# Altium schematic sheet FoxSense_Microcontroller.SchDoc
size A4; SheetNumber: 3; SheetTotal: 3
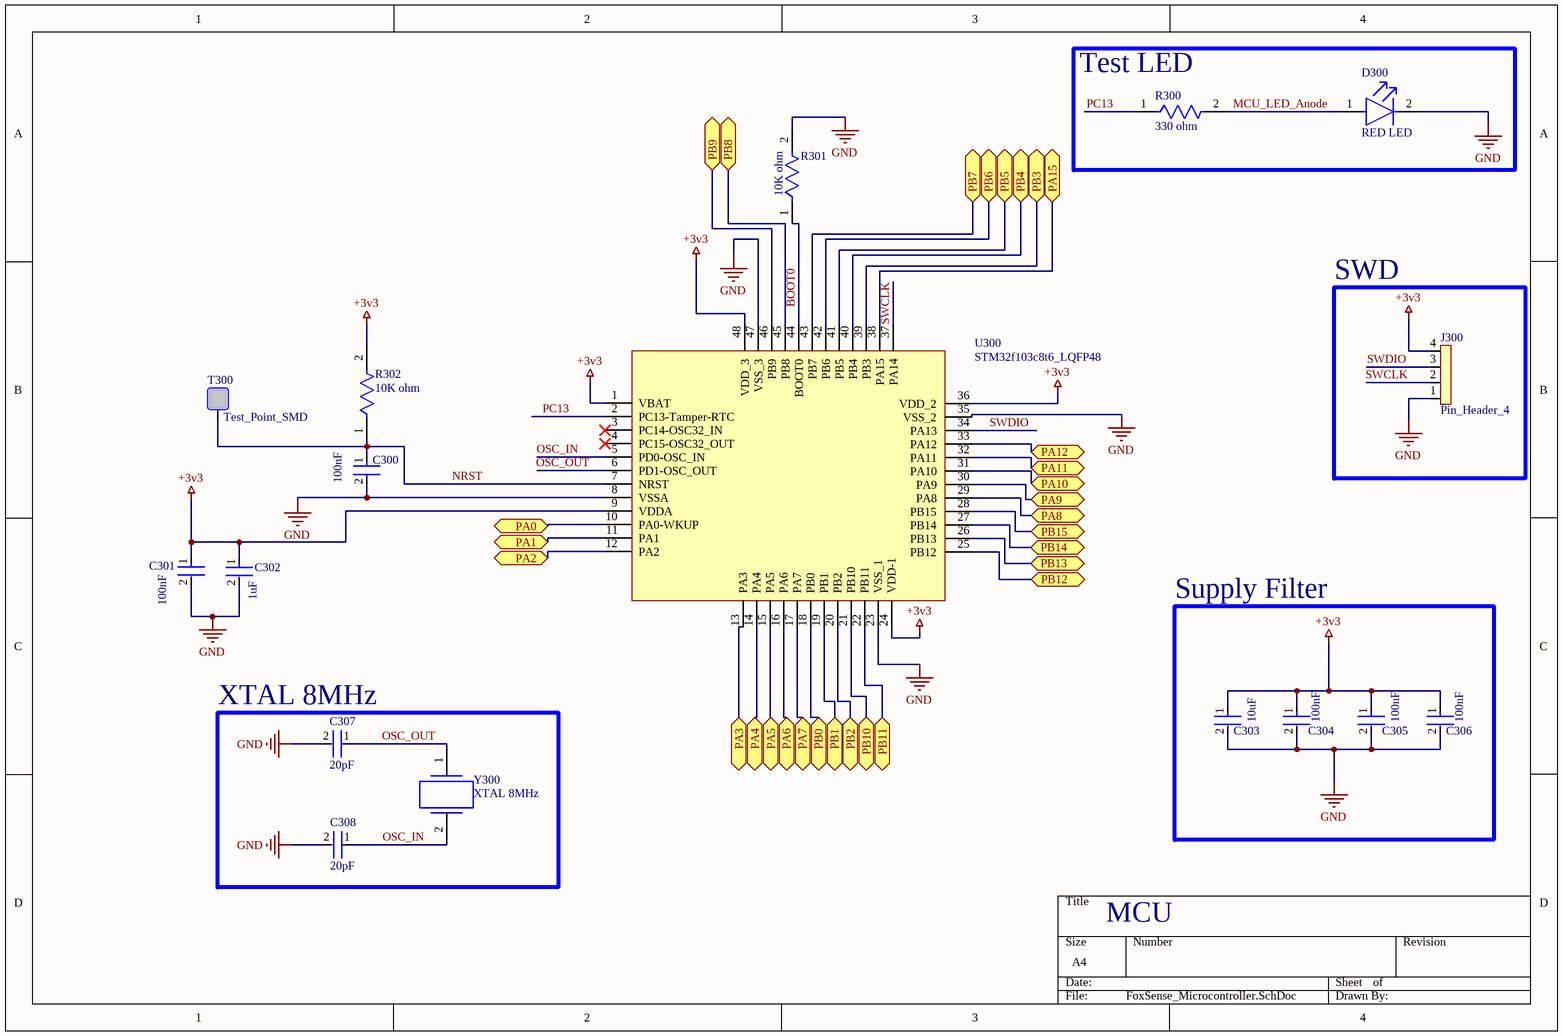
[diagram p0: FoxSense_Microcontroller.SchDoc]

## Parts
C300  100nF  [Capacitor_SMD_0805]
C301  100nF  [Capacitor_SMD_0805]
C302  1uF  [Capacitor_SMD_0805]
C303  10uF  [Capacitor_SMD_0805]
C304  100nF  [Capacitor_SMD_0805]
C305  100nF  [Capacitor_SMD_0805]
C306  100nF  [Capacitor_SMD_0805]
C307  20pF  [Capacitor_SMD_0805]
C308  20pF  [Capacitor_SMD_0805]
D300  RED LED  [LED_SMD_0805]
J300  Pin_Header_4  [Header4]
R300  330 ohm  [Resistor_SMD_0805]
R301  10K ohm  [Resistor_SMD_0805]
R302  10K ohm  [Resistor_SMD_0805]
T300  Test_Point_SMD  [TEST_Point_SMD]
U300  STM32f103c8t6_LQFP48  [STM32f103c8t6_LQFP48]
Y300  XTAL 8MHz  [Crystal_Resonator_SMD_XTAL]

## Blocks framed on the sheet
Test LED: D300 R300
SWD: J300
Supply Filter: C303-C306
XTAL 8MHz: C307 C308 Y300

## Ports
PA0 (bidir, see FoxSense_Schematic[2A]), PA1 (bidir, see FoxSense_Schematic[2B]), PA2 (bidir, see FoxSense_Schematic[2B]), PA3 (bidir, see FoxSense_Schematic[2B]), PA4 (bidir, see FoxSense_Schematic[2B]), PA5 (bidir, see FoxSense_Schematic[2B]), PA6 (bidir, see FoxSense_Schematic[2B]), PA7 (bidir, see FoxSense_Schematic[2B]), PA8 (bidir, see FoxSense_Schematic[2B]), PA9 (bidir, see FoxSense_Schematic[2B]), PA10 (bidir, see FoxSense_Schematic[2B]), PA11 (bidir, see FoxSense_Schematic[2B]), PA12 (bidir, see FoxSense_Schematic[2B]), PA15 (bidir, see FoxSense_Schematic[2B]), PB0 (bidir, see FoxSense_Schematic[3A]), PB1 (bidir, see FoxSense_Schematic[3B]), PB2 (bidir, see FoxSense_Schematic[3B]), PB3 (bidir, see FoxSense_Schematic[3B]), PB4 (bidir, see FoxSense_Schematic[3B]), PB5 (bidir, see FoxSense_Schematic[3B]), PB6 (bidir, see FoxSense_Schematic[3B]), PB7 (bidir, see FoxSense_Schematic[3B]), PB8 (bidir, see FoxSense_Schematic[3B]), PB9 (bidir, see FoxSense_Schematic[3B]), PB10 (bidir, see FoxSense_Schematic[3B]), PB11 (bidir, see FoxSense_Schematic[3B]), PB12 (bidir, see FoxSense_Schematic[3B]), PB13 (bidir, see FoxSense_Schematic[3B]), PB14 (bidir, see FoxSense_Schematic[3B]), PB15 (bidir, see FoxSense_Schematic[3B])

## Nets
+3v3: C301.1 C302.1 C303.1 C304.1 C305.1 C306.1 J300.4 R302.2 U300.1(VBAT) U300.9(VDDA) U300.24(VDD-1) U300.36(VDD_2) U300.48(VDD_3)
GND: C300.2 C301.2 C302.2 C303.2 C304.2 C305.2 C306.2 C307.2 C308.2 D300.2(C) J300.1 R301.2 U300.8(VSSA) U300.23(VSS_1) U300.35(VSS_2) U300.47(VSS_3)
BOOT0: R301.1 U300.44(BOOT0)
MCU_LED_Anode: D300.1(A) R300.2
NRST: C300.1 R302.1 T300.1 U300.7(NRST)
OSC_IN: C308.1 U300.5(PD0-OSC_IN) Y300.2
OSC_OUT: C307.1 U300.6(PD1-OSC_OUT) Y300.1
PA0: U300.10(PA0-WKUP) ; port PA0
PA1: U300.11(PA1) ; port PA1
PA2: U300.12(PA2) ; port PA2
PA3: U300.13(PA3) ; port PA3
PA4: U300.14(PA4) ; port PA4
PA5: U300.15(PA5) ; port PA5
PA6: U300.16(PA6) ; port PA6
PA7: U300.17(PA7) ; port PA7
PA8: U300.29(PA8) ; port PA8
PA9: U300.30(PA9) ; port PA9
PA10: U300.31(PA10) ; port PA10
PA11: U300.32(PA11) ; port PA11
PA12: U300.33(PA12) ; port PA12
PA15: U300.38(PA15) ; port PA15
PB0: U300.18(PB0) ; port PB0
PB1: U300.19(PB1) ; port PB1
PB2: U300.20(PB2) ; port PB2
PB3: U300.39(PB3) ; port PB3
PB4: U300.40(PB4) ; port PB4
PB5: U300.41(PB5) ; port PB5
PB6: U300.42(PB6) ; port PB6
PB7: U300.43(PB7) ; port PB7
PB8: U300.45(PB8) ; port PB8
PB9: U300.46(PB9) ; port PB9
PB10: U300.21(PB10) ; port PB10
PB11: U300.22(PB11) ; port PB11
PB12: U300.25(PB12) ; port PB12
PB13: U300.26(PB13) ; port PB13
PB14: U300.27(PB14) ; port PB14
PB15: U300.28(PB15) ; port PB15
PC13: R300.1 U300.2(PC13-Tamper-RTC)
SWCLK: J300.2 U300.37(PA14)
SWDIO: J300.3 U300.34(PA13)

Not connected (* = marked no-connect by the designer): U300 3(PC14-OSC32_IN)* 4(PC15-OSC32_OUT)*

## Notes on the sheet
- MCU

## Library data of the parts
C300 C301 C304-C306 = Capacitor_SMD_0805: capacitor smd 0805 100nF
C302 = Capacitor_SMD_0805: capacitor smd 0805
C303 = Capacitor_SMD_0805: capacitor smd 0805 10uF
C307 C308 = Capacitor_SMD_0805: capacitor smd 0805 20pF
D300 = LED_SMD_0805: LED SMD 0805
J300 = Header4: Pin Header 4
R300 = Resistor_SMD_0805: Resistor SMD 0805 330 ohm
R301 R302 = Resistor_SMD_0805: Resistor SMD 0805 10k ohm
T300 = Test_Point_SMD: Test Point SMD
U300 = STM32f103c8t6: STM32f103c8t6 LQFP48
Y300 = Crystal Resonator SMD: crystal resonator SMD 8MHz